# EAGLE design schema (EAGLE 6.5.0)
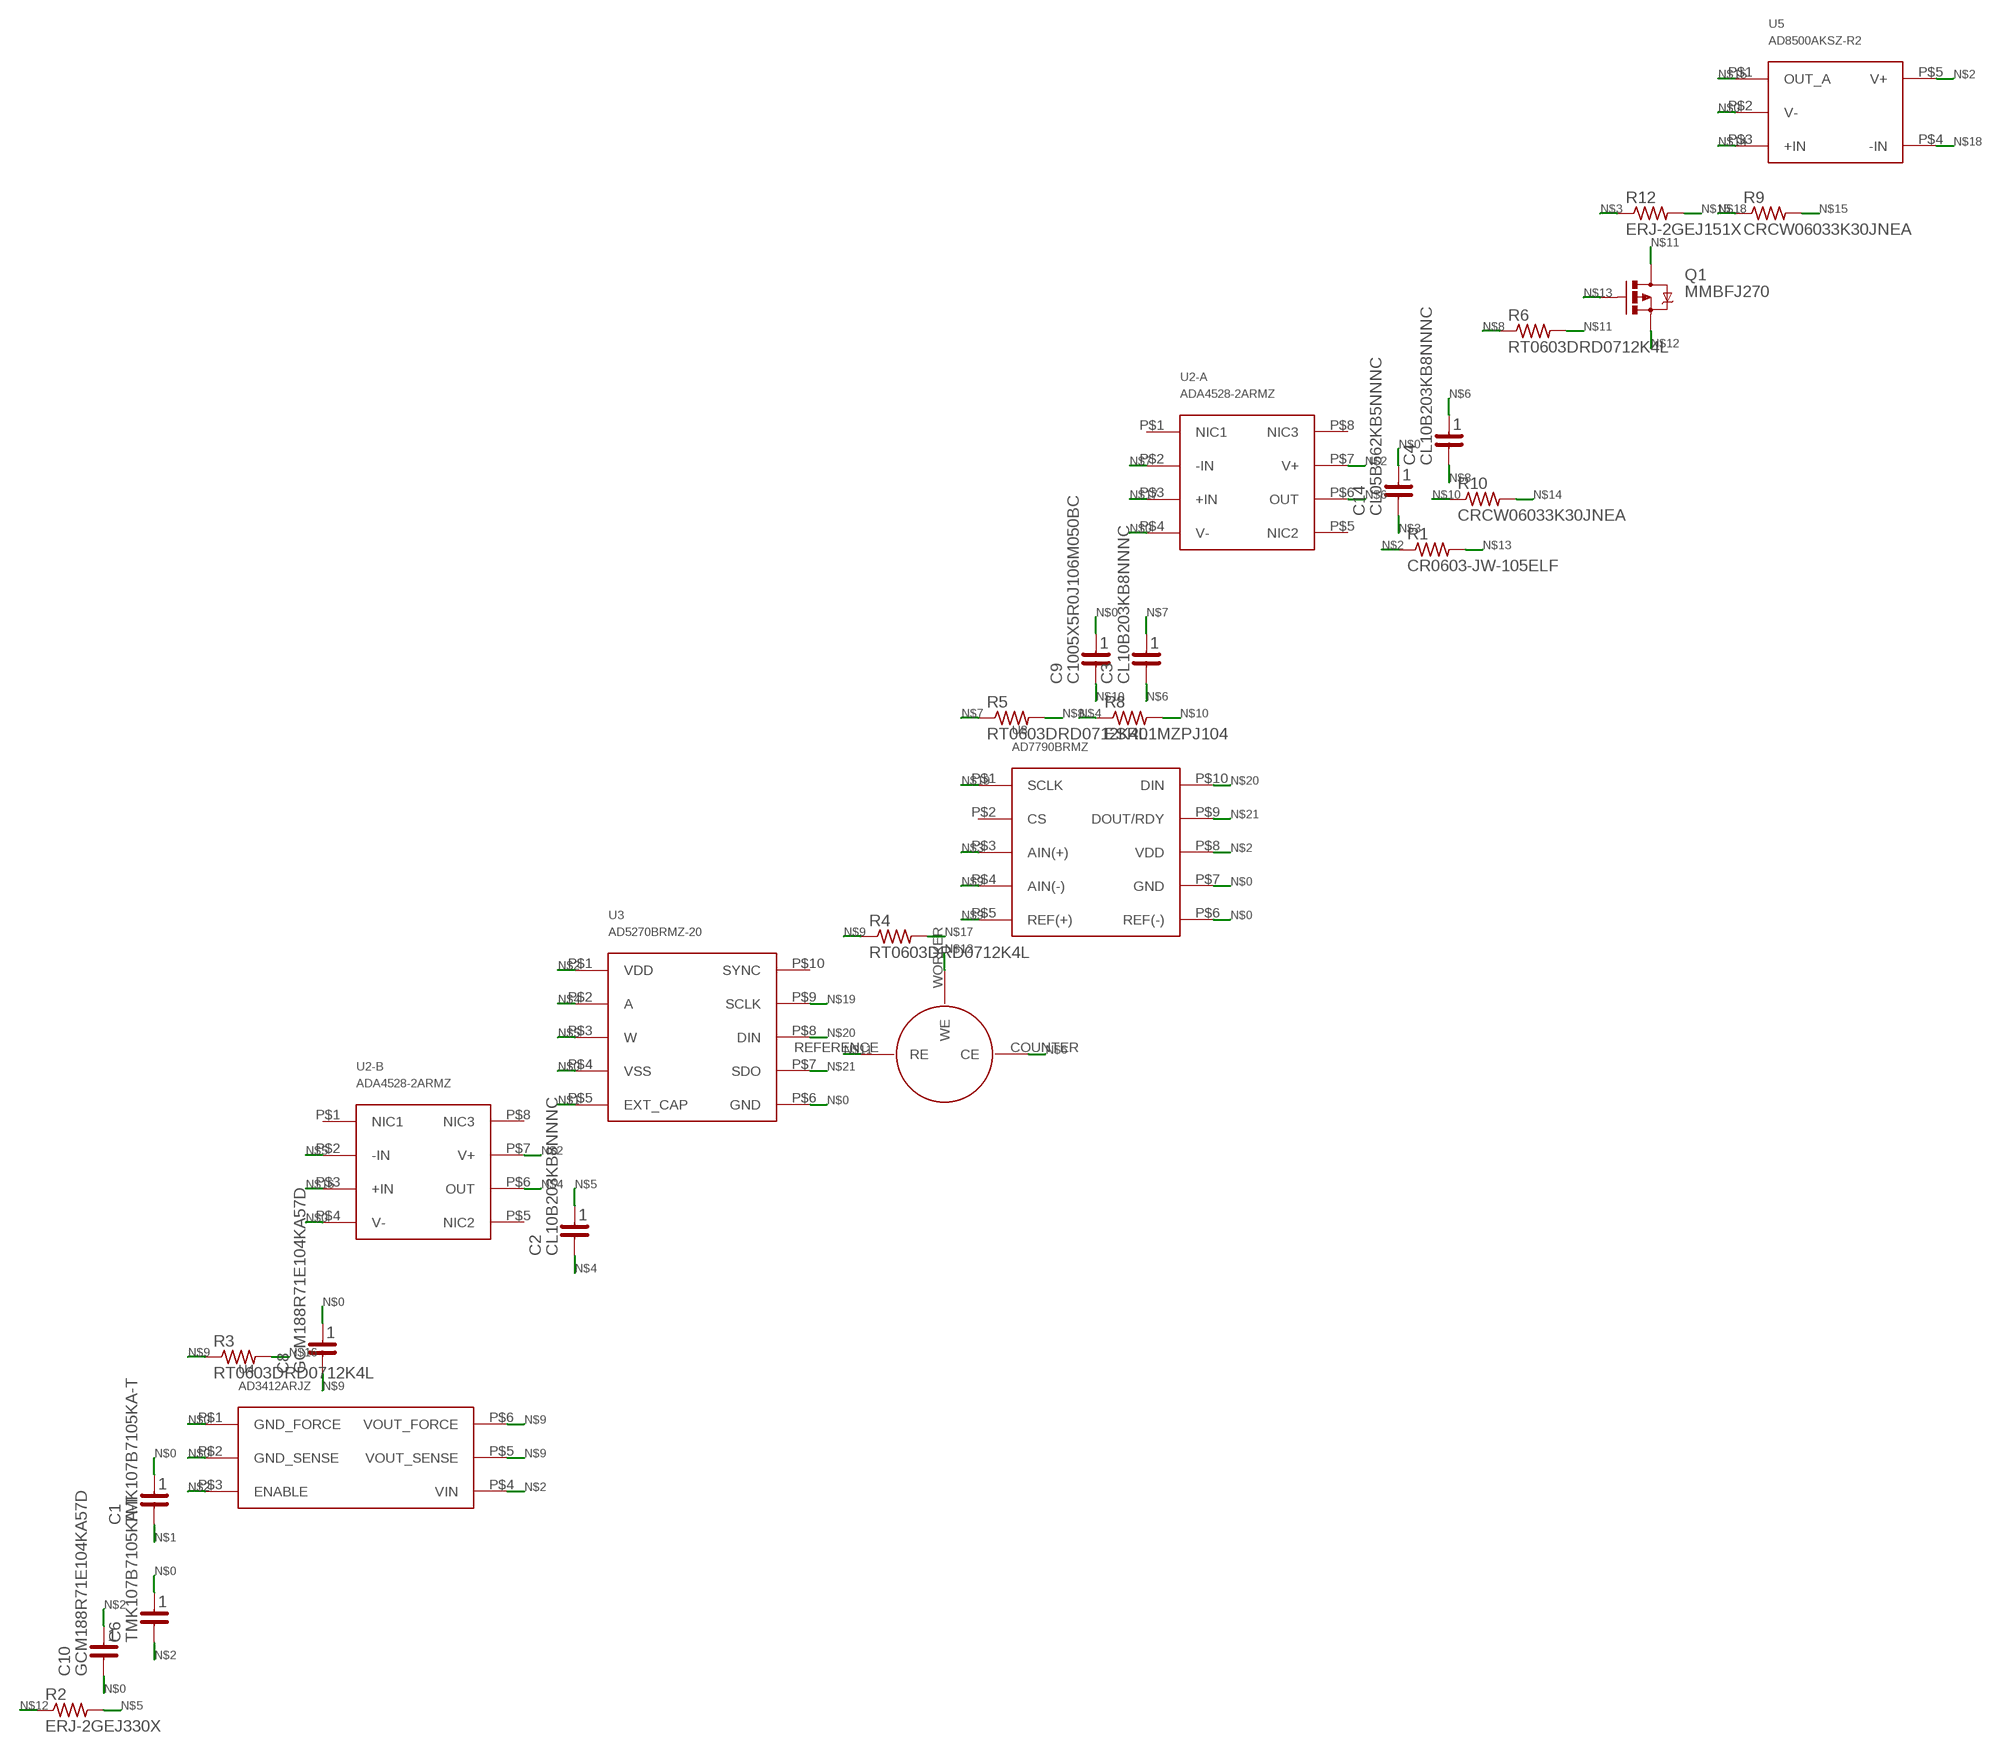
[diagram p0: schematic, sheet 1]

## Parts
C1  TMK107B7105KA-T  C_0603  [C_0603]
C2  CL10B203KB8NNNC  C_0603  [C_0603]
C3  CL10B203KB8NNNC  C_0603  [C_0603]
C4  CL10B203KB8NNNC  C_0603  [C_0603]
C6  TMK107B7105KA-T  C_0603  [C_0603]
C8  GCM188R71E104KA57D  C_0603  [C_0603]
C9  C1005X5R0J106M050BC  C_0402  [C_0402]
C10  GCM188R71E104KA57D  C_0603  [C_0603]
C14  CL05B562KB5NNNC  C_0402  [C_0402]
Q1  MMBFJ270  [SOT23-3]
R1  CR0603-JW-105ELF  RESISTOR_0603  [R_0603]
R2  ERJ-2GEJ330X  RESISTOR_0402  [R_0402]
R3  RT0603DRD0712K4L  RESISTOR_0603  [R_0603]
R4  RT0603DRD0712K4L  RESISTOR_0603  [R_0603]
R5  RT0603DRD0712K4L  RESISTOR_0603  [R_0603]
R6  RT0603DRD0712K4L  RESISTOR_0603  [R_0603]
R8  ESR01MZPJ104  RESISTOR_0402  [R_0402]
R9  CRCW06033K30JNEA  RESISTOR_0603  [R_0603]
R10  CRCW06033K30JNEA  RESISTOR_0603  [R_0603]
R12  ERJ-2GEJ151X  RESISTOR_0402  [R_0402]
U1  CO-AX  [CO-AX]
U2-A  ADA4528-2ARMZ  [MSOP-8]
U2-B  ADA4528-2ARMZ  [MSOP-8]
U3  AD5270BRMZ-20  [MSOP-10]
U4  AD3412ARJZ  [SOT-23]
U5  AD8500AKSZ-R2  [SC-70]
U8  AD7790BRMZ  [MSOP-10]

## Nets
N$0: C1.1 C6.1 C8.1 C9.1 C10.2 C14.1 U2-A.P$4(V-) U2-B.P$4(V-) U3.P$4(VSS) U3.P$6(GND) U4.P$1(GND_FORCE) U4.P$2(GND_SENSE) U5.P$2(V-) U8.P$6(REF(-)) U8.P$7(GND)
N$1: C1.2 U3.P$5(EXT_CAP)
N$2: C6.2 C10.1 R1.P$1 U2-A.P$7(V+) U2-B.P$7(V+) U3.P$1(VDD) U4.P$3(ENABLE) U4.P$4(VIN) U5.P$5(V+) U8.P$8(VDD)
N$3: C14.2 R12.P$1 U8.P$3(AIN(+))
N$4: C2.2 R8.P$1 U2-B.P$6(OUT) U3.P$2(A)
N$5: C2.1 R2.P$2 U2-B.P$2(-IN) U3.P$3(W)
N$6: C3.2 C4.1 U1.COUNTER(CE) U2-A.P$6(OUT)
N$7: C3.1 R5.P$1 U2-A.P$2(-IN)
N$8: C4.2 R5.P$2 R6.P$1
N$9: C8.2 R3.P$1 R4.P$1 U4.P$5(VOUT_SENSE) U4.P$6(VOUT_FORCE) U8.P$4(AIN(-)) U8.P$5(REF(+))
N$10: C9.2 R8.P$2 R10.P$1
N$11: Q1.1(D) R6.P$2 U1.REFERENCE(RE)
N$12: Q1.2(S) R2.P$1 U1.WORKER(WE)
N$13: Q1.3(G) R1.P$2
N$14: R10.P$2 U5.P$3(+IN)
N$15: R9.P$2 R12.P$2 U5.P$1(OUT_A)
N$16: R3.P$2 U2-B.P$3(+IN)
N$17: R4.P$2 U2-A.P$3(+IN)
N$18: R9.P$1 U5.P$4(-IN)
N$19: U3.P$9(SCLK) U8.P$1(SCLK)
N$20: U3.P$8(DIN) U8.P$10(DIN)
N$21: U3.P$7(SDO) U8.P$9(DOUT/RDY)
Unconnected: U2-A.P$1(NIC1) U2-A.P$5(NIC2) U2-A.P$8(NIC3) U2-B.P$1(NIC1) U2-B.P$5(NIC2) U2-B.P$8(NIC3) U3.P$10(SYNC) U8.P$2(CS)

## Library data of the parts
C1-C4 C6 C8 C10 = mlcc:C_0603
C9 C14 = mlcc:C_0402
Q1 = Toxic Gas Detector:MMBFJ270
R1 R3-R6 R9 R10 = resistor:RESISTOR_0603
R2 R8 R12 = resistor:RESISTOR_0402
U1 = Toxic Gas Detector:CO-AX
U2-A U2-B = Toxic Gas Detector:ADA4528-2ARMZ
U3 = Toxic Gas Detector:AD5270BRMZ-20
U4 = Toxic Gas Detector:AD3412ARJZ
U5 = Toxic Gas Detector:AD8500AKSZ-R2
U8 = Toxic Gas Detector:AD7790BRMZ

## Board
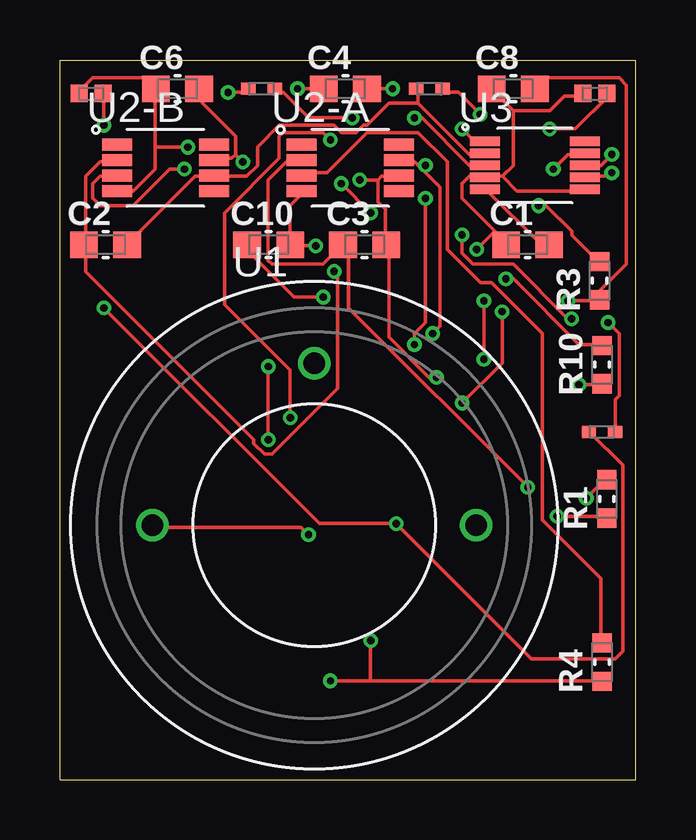
[diagram p1: board, top side]
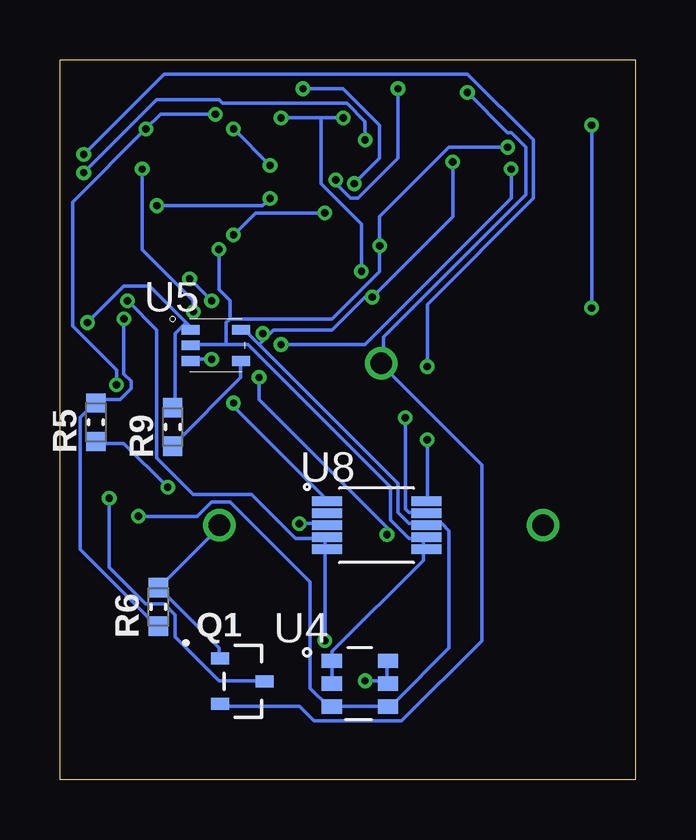
[diagram p2: board, bottom side, seen from below]

Size 24 x 30 mm. Coordinates in mm from the lower left corner, seen from the top.
Outline: 0,0 24,0 24,30 0,30 0,0
Copper layers (1*16): Top 0.035mm / dielectric 0.2mm / Bottom 0.035mm
Design rules "MacroFab_2_Layer": minimum track width 6mil, minimum drill 12mil, track to track 6mil, track to pad 6mil, pad to pad 6mil, via to via 6mil, smd to smd 0mil, copper to edge 10mil, drill to drill 10mil, minimum pad ring 6mil, minimum via ring 6mil, stop-mask expansion 2mil, vias tented up to drill 25mil, thermal gap 10mil

### Footprints (pad centres in the part's own frame; a part is rotated, then mirrored left to right if it is on the bottom)
C_0603 = smd 1.15 x 1.1: 1 -0.9,0; 2 0.9,0
C_0402 = smd 0.72 x 0.72: 1 -0.5,0; 2 0.5,0
SOT23-3 = smd 0.75 x 0.5: 1 -0.925,0.95; 2 -0.925,-0.95; 3 0.925,0
R_0603 = smd 0.8 x 0.8: P$1 -0.8,0; P$2 0.8,0
R_0402 = smd 0.6 x 0.5: P$1 -0.55,0; P$2 0.55,0
CO-AX = drill 0.9: COUNTER -6.75,0; REFERENCE 6.75,0; WORKER 0,6.75
MSOP-8 = smd 1.25 x 0.5: P$1 -2.025,0.975; P$2 -2.025,0.325; P$3 -2.025,-0.325; P$4 -2.025,-0.975; P$5 2.025,-0.975; P$6 2.025,-0.325; P$7 2.025,0.325; P$8 2.025,0.975
MSOP-10 = smd 1.25 x 0.4: P$1 -2.075,1; P$2 -2.075,0.5; P$3 -2.075,0; P$4 -2.075,-0.5; P$5 -2.075,-1; P$6 2.075,-1; P$7 2.075,-0.5; P$8 2.075,0; P$9 2.075,0.5; P$10 2.075,1
SOT-23 = smd 0.85 x 0.6: P$1 -1.175,0.95; P$2 -1.175,0; P$3 -1.175,-0.95; P$4 1.175,-0.95; P$5 1.175,0; P$6 1.175,0.95
SC-70 = smd 0.75 x 0.4: P$1 -1.05,0.65; P$2 -1.05,0; P$3 -1.05,-0.65; P$4 1.05,-0.65; P$5 1.05,0.65

### Placement (x,y rotation side)
C1  19.5,22.3 0 top
C2  1.9,22.3 0 top
C3  12.7,22.3 0 top
C4  11.9,28.8 0 top
C6  4.9,28.8 0 top
C8  18.9,28.8 0 top
C9  22.3,28.6 0 top
C10  8.7,22.3 0 top
C14  1.3,28.6 0 top
Q1  16.4,4.1 0 bottom
R1  22.8,11.7 90 top
R2  8.4,28.8 0 top
R3  22.5,20.8 90 top
R4  22.6,4.9 90 top
R5  22.5,14.9 90 bottom
R6  19.9,7.2 90 bottom
R8  15.4,28.8 0 top
R9  19.3,14.7 90 bottom
R10  22.6,17.3 90 top
R12  22.6,14.5 0 top
U1  10.6,10.6 0 top
U2-A  12.1,25.5 0 top
U2-B  4.4,25.5 0 top
U3  19.8,25.6 0 top
U4  11.5,4 0 bottom
U5  17.5,18.1 0 bottom
U8  10.8,10.6 0 bottom

### Tracks (layer width: path | path; a pad name or v marks a point on that pad's centre or on a via)
N$0  (via drill 0.3)
  Top 0.152: 18.9,27.89 20.42,27.89 21.03,28.5 21.79,28.5 C9.1 | 18.9,27.89 18.14,28.65 C8.1 | 18.14,22.86 16.76,24.23 16.76,24.84 17.07,25.15 17.68,25.15 U3.P$4 17.83,25.15 18.44,25.15 | 18.14,22.86 18.59,22.4 C1.1 | 18.44,25.15 19.05,24.54 21.79,24.54 U3.P$6 | 18.9,27.89 18.9,25.6 18.44,25.15 | C14.1 0.91,28.65 0.91,28.8 1.37,29.26 3.5,29.26 3.96,28.8 C6.1 3.96,28.65 3.96,26.36 | 3.96,26.36 3.96,25.45 3.05,24.54 2.44,24.54 U2-B.P$4 | U2-A.P$4 10.06,24.38 9.6,23.93 9.6,22.4 C10.2 9.6,22.25 v10.67,22.25 | v5.33,26.36 3.96,26.36 | v17.37,22.1 18.14,22.86
  Bottom 0.152: U4.P$2 12.65,4.12 12.65,4.88 U4.P$1 12.65,5.03 12.65,5.33 8.84,9.14 8.84,9.45 U8.P$6 8.84,9.6 8.84,10.06 | 17.07,18.14 16.15,18.14 10.21,12.19 10.21,10.82 9.45,10.06 8.84,10.06 | 17.07,18.14 18.44,18.14 U5.P$2 | 16.92,19.2 12.65,19.2 10.67,21.18 v10.67,22.25 10.67,23.47 7.77,26.36 v5.33,26.36 | 16.92,19.2 17.07,19.05 17.07,18.14 | 8.84,10.06 U8.P$7 | v17.37,22.1 17.37,20.42 16.92,19.96 16.92,19.2
N$1
  Top 0.152: C1.2 20.27,22.4 19.96,22.4 17.83,24.54 U3.P$5
N$2  (via drill 0.3)
  Top 0.152: v20.73,10.97 22.71,10.97 R1.P$1 | 7.32,26.06 7.32,26.82 5.94,28.19 5.94,28.65 C6.2 | 7.32,26.06 7.16,25.91 6.55,25.91 U2-B.P$7 | v10.97,20.12 9.75,20.12 7.92,21.95 7.92,22.25 C10.1 | 15.09,25.45 15.85,24.69 15.85,18.9 v15.54,18.59 | 15.09,25.45 14.78,25.76 14.17,25.76 U2-A.P$7 | v16.76,27.13 17.22,26.67 17.68,26.67 U3.P$1 | 15.09,25.45 v15.24,25.6 | v7.62,25.76 7.32,26.06
  Bottom 0.152: v20.73,10.97 18.29,10.97 17.68,11.58 16.92,11.58 13.56,8.23 13.56,3.81 12.8,3.05 U4.P$3 12.65,3.05 10.36,3.05 U4.P$4 10.21,3.2 10.06,3.2 7.77,5.49 7.77,10.36 8.08,10.67 8.69,10.67 U8.P$8 8.84,10.67 9.45,10.67 9.91,11.12 9.91,12.34 15.7,18.14 | 15.7,18.14 16.31,18.75 U5.P$5 | 15.7,18.14 15.39,18.44 | 15.39,18.44 15.09,18.75 12.65,18.75 11.28,20.12 v10.97,20.12 7.62,23.47 v7.62,25.76 | 15.39,18.44 v15.54,18.59 | v15.24,25.6 v16.76,27.13
N$3  (via drill 0.3)
  Top 0.152: R12.P$1 22.1,14.48 23.47,13.11 23.47,5.33 23.16,5.03 19.66,5.03 v14.02,10.67 10.82,10.67 v1.83,19.66 | v1.83,27.28 1.83,28.5 C14.2
  Bottom 0.152: v14.02,10.67 12.95,10.67 U8.P$3 | v1.83,19.66 v1.83,27.28
N$4
  Top 0.152: 14.94,28.19 14.94,28.65 R8.P$1 | 14.94,28.19 17.07,26.06 17.68,26.06 U3.P$2 | C2.2 2.9,22.4 5.64,25.15 6.4,25.15 U2-B.P$6 6.55,25.15 7.77,25.15 8.23,25.6 8.23,26.36 9.14,27.28 11.43,27.28 11.73,26.98 12.34,26.98 12.65,27.28 12.8,27.28 13.72,28.19 14.94,28.19
N$5  (via drill 0.3)
  Top 0.152: U2-B.P$2 2.29,25.76 1.68,25.76 1.07,25.15 1.07,22.4 C2.1 1.07,22.25 1.07,21.18 8.08,14.17 8.08,14.02 8.53,13.56 8.84,13.56 11.58,16.31 11.58,21.03 v11.43,21.18 | v12.19,27.58 10.36,27.58 9.3,28.65 8.99,28.65 R2.P$2 | v14.78,27.58 15.09,27.58 17.07,25.6 17.68,25.6 U3.P$3
  Bottom 0.152: v14.78,27.58 13.11,27.58 | 13.11,27.58 v12.19,27.58 | v11.43,21.18 11.43,23.16 13.11,24.84 13.11,27.58
N$6  (via drill 0.3)
  Top 0.152: 13.26,24.99 13.26,24.08 13.56,23.77 13.56,22.4 C3.2 13.72,22.25 13.72,18.44 15.39,16.76 v15.7,16.76 | 13.26,24.99 13.41,25.15 14.02,25.15 U2-A.P$6 | v9.91,28.8 10.97,28.8 C4.1 | 13.26,24.99 v12.5,24.99 | v10.36,10.21 10.06,10.52 3.96,10.52 U1.COUNTER
  Bottom 0.152: v9.91,28.8 9.91,25.91 11.58,24.23 11.89,24.23 12.5,24.84 v12.5,24.99 | v10.36,10.21 10.36,10.52 15.7,15.85 v15.7,16.76
N$7  (via drill 0.3)
  Top 0.152: v19.51,12.19 12.04,19.66 12.04,22.1 11.89,22.25 C3.1 11.73,22.25 10.97,21.49 8.84,21.49 8.69,21.64 8.69,24.99 9.45,25.76 10.06,25.76 U2-A.P$2
  Bottom 0.152: v19.51,12.19 21.34,14.02 22.4,14.02 R5.P$1
N$8  (via drill 0.3)
  Top 0.152: v13.87,28.8 C4.2 | v12.95,23.62 v11.73,24.84 | v16.76,22.71 16.76,21.95 17.22,21.49 18.9,21.49 21.18,19.2 v21.34,19.2
  Bottom 0.152: R6.P$1 19.96,6.4 23.16,9.6 23.16,15.09 22.55,15.7 R5.P$2 22.4,15.85 21.49,15.85 21.03,16.31 21.03,16.61 21.34,16.92 v21.34,19.2 | v13.87,28.8 12.19,28.8 10.67,27.28 10.67,25.91 v11.73,24.84 | v12.95,23.62 15.85,23.62 v16.76,22.71
N$9  (via drill 0.3)
  Top 0.152: C8.2 19.81,28.8 20.27,29.26 23.32,29.26 23.62,28.96 23.62,21.49 22.55,20.42 22.55,20.12 R3.P$1 22.4,19.96 v21.18,19.96 | v11.28,4.12 12.95,4.12 | 12.95,4.12 22.55,4.12 R4.P$1 | 12.95,4.12 v12.95,5.79
  Bottom 0.152: 12.95,10.06 12.95,9.6 U8.P$5 12.95,9.45 v12.95,5.79 | 10.36,4.12 v11.28,4.12 | 10.36,4.12 10.36,4.88 U4.P$6 | 10.36,4.12 U4.P$5 | v21.18,19.96 19.96,18.75 19.96,13.41 18.44,11.89 16,11.89 14.17,10.06 12.95,10.06 | 12.95,10.06 U8.P$4
N$10  (via drill 0.3)
  Top 0.152: v17.53,27.74 16.61,28.65 16,28.65 R8.P$2 | v20.42,27.13 21.49,27.13 22.86,28.5 C9.2 | v21.64,16.46 22.55,16.46 R10.P$1
  Bottom 0.152: v17.53,27.74 19.81,27.74 v20.42,27.13 23.47,24.08 23.47,18.9 21.64,17.07 v21.64,16.46
N$11
  Bottom 0.152: Q1.1 17.37,5.18 17.37,5.49 19.81,7.92 R6.P$2 19.81,8.08 17.37,10.52 U1.REFERENCE
N$12  (via drill 0.3)
  Top 0.152: v7.01,28.65 7.77,28.65 R2.P$1
  Bottom 0.152: v7.01,28.65 5.33,26.98 5.18,26.98 4.57,26.36 4.57,24.38 10.52,18.44 10.52,17.37 U1.WORKER 10.52,17.22 6.4,13.11 6.4,5.79 9.75,2.44 13.41,2.44 14.02,3.05 17.22,3.05 Q1.2
N$13  (via drill 0.3)
  Top 0.152: v21.95,11.73 22.71,12.5 R1.P$2
  Bottom 0.152: v21.95,11.73 21.95,8.84 20.42,7.32 19.66,7.32 19.2,6.86 19.2,5.94 17.37,4.12 15.54,4.12 Q1.3
N$14  (via drill 0.3)
  Top 0.152: v17.68,19.96 v17.68,17.53 | v18.59,20.88 18.9,20.88 21.64,18.14 22.55,18.14 R10.P$2
  Bottom 0.152: v17.68,17.53 18.44,17.53 U5.P$3 | v18.59,20.88 v17.68,19.96
N$15  (via drill 0.3)
  Top 0.152: v22.86,19.05 23.32,18.59 23.32,16 23.16,15.85 23.16,14.63 R12.P$2
  Bottom 0.152: v22.86,19.05 21.34,20.57 20.27,20.57 18.75,19.05 | 18.75,19.05 18.59,18.9 U5.P$1 | 18.75,19.05 19.2,18.59 19.2,15.54 R9.P$2
N$16  (via drill 0.3)
  Top 0.152: v19.96,23.93 20.27,23.93 21.34,22.86 21.34,22.71 22.4,21.64 R3.P$2 | v15.24,24.23 15.24,19.05 14.78,18.59 v14.78,18.14 | v5.18,25.45 4.57,25.45 3.05,23.93 1.68,23.93 1.37,24.23 1.37,24.84 1.68,25.15 2.29,25.15 U2-B.P$3
  Bottom 0.152: v19.96,23.93 15.54,23.93 v15.24,24.23 | v14.78,18.14 11.28,18.14 5.18,24.23 v5.18,25.45
N$17
  Top 0.152: R4.P$2 22.55,5.79 22.55,8.38 20.12,10.82 20.12,18.59 17.98,20.73 17.53,20.73 16.15,22.1 16.15,25.76 14.94,26.98 12.8,26.98 11.12,25.3 10.21,25.3 U2-A.P$3
N$18
  Bottom 0.152: U5.P$4 16.46,17.37 16.46,16.76 19.2,14.02 R9.P$1
N$19  (via drill 0.3)
  Top 0.152: v16.76,15.7 18.44,17.37 v18.44,19.51 | v20.57,25.45 21.18,26.06 21.79,26.06 U3.P$9
  Bottom 0.152: v16.76,15.7 16.76,15.54 12.95,11.73 U8.P$1 | v18.44,19.51 18.44,19.96 20.57,22.1 v20.57,25.45
N$20  (via drill 0.3)
  Top 0.152: v8.69,17.22 v8.69,14.17 | v23.01,26.06 22.55,25.6 21.95,25.6 U3.P$8
  Bottom 0.152: v8.69,14.17 8.69,11.73 U8.P$10 | v8.69,17.22 8.69,19.81 4.27,24.23 4.27,26.67 7.01,29.41 19.66,29.41 v23.01,26.06
N$21  (via drill 0.3)
  Top 0.152: v9.6,15.09 9.6,17.07 6.86,19.81 6.86,23.62 9.14,25.91 9.14,26.82 9.3,26.98 10.97,26.98 v11.28,26.67 | v23.01,25.3 22.86,25.3 22.71,25.15 21.95,25.15 U3.P$7
  Bottom 0.152: v9.6,15.09 9.6,11.28 9.45,11.12 8.84,11.12 U8.P$9 | v11.28,26.67 11.28,27.43 12.04,28.19 17.22,28.19 17.37,28.35 19.96,28.35 v23.01,25.3